# Altium schematic sheet power.SchDoc
size A4
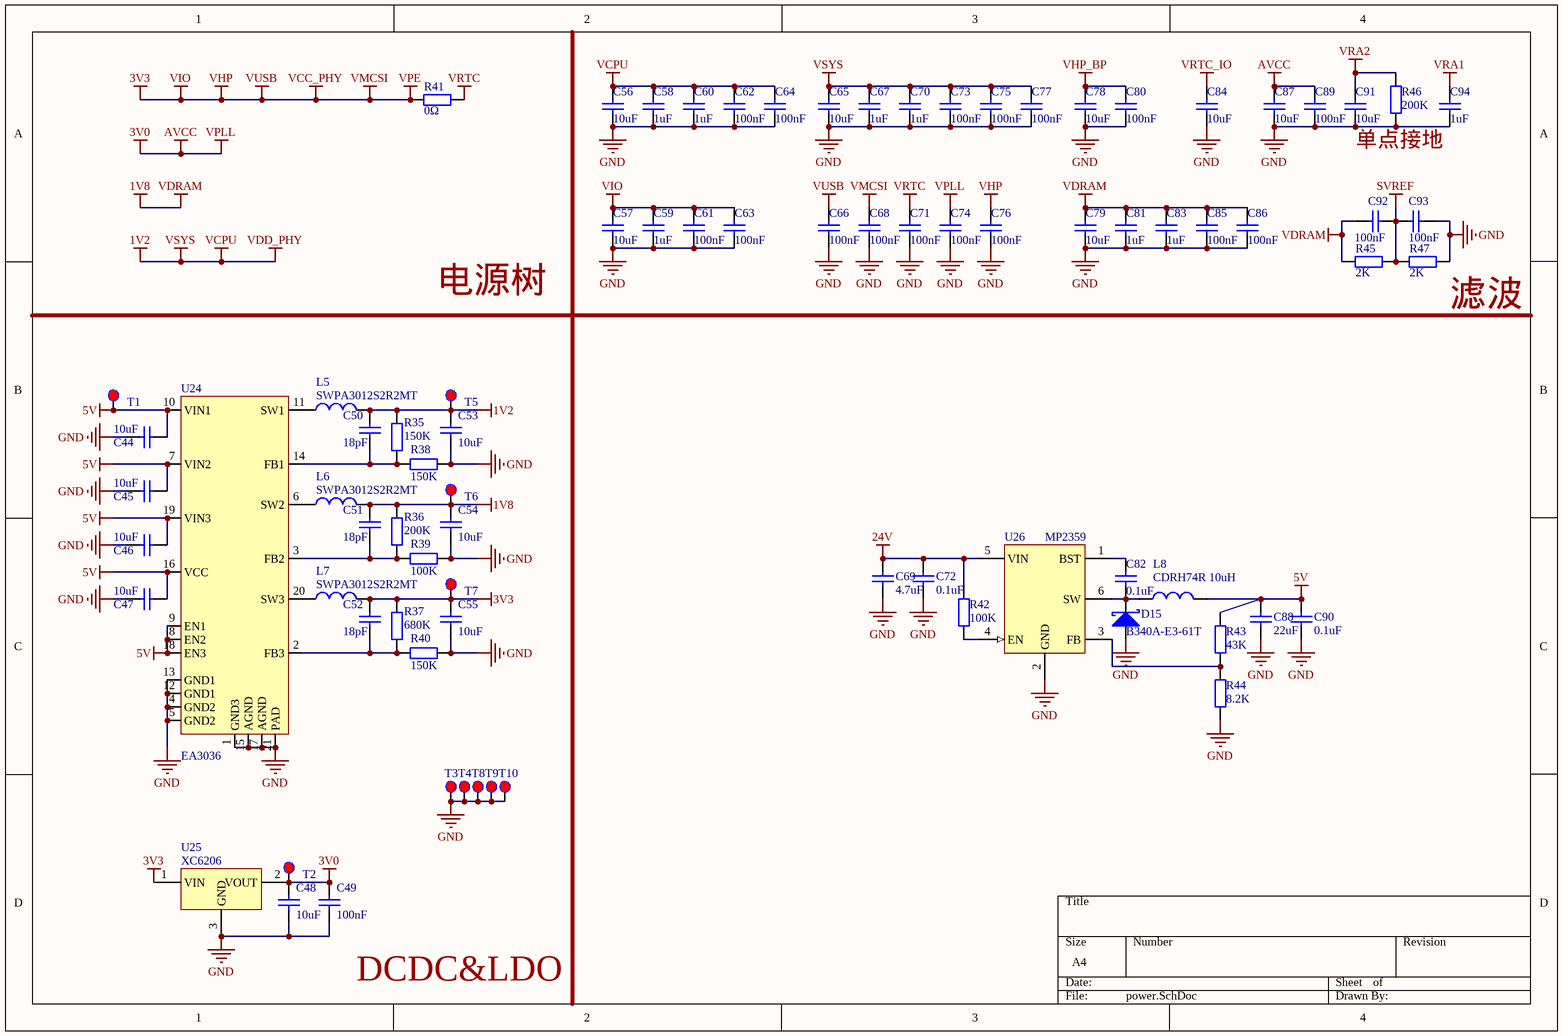
[diagram p0: power.SchDoc]

## Parts
C44  10uF  [CAPC1608L]
C45  10uF  [CAPC1608L]
C46  10uF  [CAPC1608L]
C47  10uF  [CAPC1608L]
C48  10uF  [CAPC1608L]
C49  100nF  [CAPC1608L]
C50  18pF  [CAPC1608L]
C51  18pF  [CAPC1608L]
C52  18pF  [CAPC1608L]
C53  10uF  [CAPC1608L]
C54  10uF  [CAPC1608L]
C55  10uF  [CAPC1608L]
C56  10uF  [CAPC1608L]
C57  10uF  [CAPC1608L]
C58  1uF  [CAPC1608L]
C59  1uF  [CAPC1608L]
C60  1uF  [CAPC1608L]
C61  100nF  [CAPC1608L]
C62  100nF  [CAPC1608L]
C63  100nF  [CAPC1608L]
C64  100nF  [CAPC1608L]
C65  10uF  [CAPC1608L]
C66  100nF  [CAPC1608L]
C67  1uF  [CAPC1608L]
C68  100nF  [CAPC1608L]
C69  4.7uF  [CAPC3216L]
C70  1uF  [CAPC1608L]
C71  100nF  [CAPC1608L]
C72  0.1uF  [CAPC2012L]
C73  100nF  [CAPC1608L]
C74  100nF  [CAPC1608L]
C75  100nF  [CAPC1608L]
C76  100nF  [CAPC1608L]
C77  100nF  [CAPC1608L]
C78  10uF  [CAPC1608L]
C79  10uF  [CAPC1608L]
C80  100nF  [CAPC1608L]
C81  1uF  [CAPC1608L]
C82  0.1uF  [CAPC1608L]
C83  1uF  [CAPC1608L]
C84  10uF  [CAPC1608L]
C85  100nF  [CAPC1608L]
C86  100nF  [CAPC1608L]
C87  10uF  [CAPC1608L]
C88  22uF  [CAPC3216L]
C89  100nF  [CAPC1608L]
C90  0.1uF  [CAPC2012L]
C91  10uF  [CAPC1608L]
C92  100nF  [CAPC1608L]
C93  100nF  [CAPC1608L]
C94  1uF  [CAPC1608L]
D15  B340A-E3-61T  [DO-214AC]
L5  SWPA3012S2R2MT  [IND3012_L]
L6  SWPA3012S2R2MT  [IND3012_L]
L7  SWPA3012S2R2MT  [IND3012_L]
L8  CDRH74R 10uH  [IND_7545]
R35  150K  [RESC1608L]
R36  200K  [RESC1608L]
R37  680K  [RESC1608L]
R38  150K  [RESC1608L]
R39  100K  [RESC1608L]
R40  150K  [RESC1608L]
R41  0Ω  [RESC1608L]
R42  100K  [RESC1608L]
R43  43K  [RESC1608L]
R44  8.2K  [RESC1608L]
R45  2K  [RESC1608L]
R46  200K  [RESC1608L]
R47  2K  [RESC1608L]
T1  TEST_POINT  [TEST_POINT_0.8]  (value not drawn)
T2  TEST_POINT  [TEST_POINT_0.8]  (value not drawn)
T3  TEST_POINT  [TEST_POINT_0.8]  (value not drawn)
T4  TEST_POINT  [TEST_POINT_0.8]  (value not drawn)
T5  TEST_POINT  [TEST_POINT_0.8]  (value not drawn)
T6  TEST_POINT  [TEST_POINT_0.8]  (value not drawn)
T7  TEST_POINT  [TEST_POINT_0.8]  (value not drawn)
T8  TEST_POINT  [TEST_POINT_0.8]  (value not drawn)
T9  TEST_POINT  [TEST_POINT_0.8]  (value not drawn)
T10  TEST_POINT  [TEST_POINT_0.8]  (value not drawn)
U24  EA3036  [QFN20_L]
U25  XC6206  [SOT23_L]
U26  MP2359  [SOT23-6_L]

## Nets
1V2: C50.2 C53.2 C56.2 C58.2 C60.2 C62.2 C64.2 C65.2 C67.2 C70.2 C73.2 C75.2 C77.2 L5.2 R35.2 T5.1  [also labelled VCPU, VDD_PHY, VSYS]
1V8: C51.2 C54.2 C79.2 C81.2 C83.2 C85.2 C86.2 C92.2 L6.2 R36.2 R45.1 T6.1  [also labelled VDRAM]
3V0: C48.2 C49.2 C74.2 C87.2 C89.2 T2.1 U25.2(VOUT)  [also labelled AVCC, VPLL]
3V3: C52.2 C55.2 C57.2 C59.2 C61.2 C63.2 C66.2 C68.2 C76.2 L7.2 R37.2 R41.1 T7.1 U25.1(VIN)  [also labelled VCC_PHY, VHP, VIO, VMCSI, VPE, VUSB]
5V: C44.1 C45.1 C46.1 C47.1 C88.2 C90.2 L8.2 R43.2 T1.1 U24.7(VIN2) U24.8(EN2) U24.9(EN1) U24.10(VIN1) U24.16(VCC) U24.18(EN3) U24.19(VIN3)
24V: C69.2 C72.2 R42.2 U26.5(VIN)
GND: C44.2 C45.2 C46.2 C47.2 C48.1 C49.1 C53.1 C54.1 C55.1 C56.1 C57.1 C58.1 C59.1 C60.1 C61.1 C62.1 C63.1 C64.1 C65.1 C66.1 C67.1 C68.1 C69.1 C70.1 C71.1 C72.1 C73.1 C74.1 C75.1 C76.1 C77.1 C78.1 C79.1 C80.1 C81.1 C83.1 C84.1 C85.1 C86.1 C87.1 C88.1 C89.1 C90.1 C91.1 C93.1 C94.1 D15.1(A) R38.1 R39.1 R40.1 R44.1 R46.1 R47.2 T3.1 T4.1 T8.1 T9.1 T10.1 U24.1(GND3) U24.4(GND2) U24.5(GND2) U24.12(GND1) U24.13(GND1) U24.15(AGND) U24.17(AGND) U24.21(PAD) U25.3(GND) U26.2(GND)
SVREF: C92.1 C93.2 R45.2 R47.1
VHP_BP: C78.2 C80.2
VRA1: C94.2
VRA2: C91.2 R46.2
VRTC: C71.2 R41.2
VRTC_IO: C84.2
NetC50_1: C50.1 R35.1 R38.2 U24.14(FB1)
NetC51_1: C51.1 R36.1 R39.2 U24.3(FB2)
NetC52_1: C52.1 R37.1 R40.2 U24.2(FB3)
NetC82_1: C82.1 D15.2(K) L8.1 U26.6(SW)
NetC82_2: C82.2 U26.1(BST)
NetL5_1: L5.1 U24.11(SW1)
NetL6_1: L6.1 U24.6(SW2)
NetL7_1: L7.1 U24.20(SW3)
NetR42_1: R42.1 U26.4(EN)
NetR43_1: R43.1 R44.2 U26.3(FB)

## Notes on the sheet
- 单点接地
- 电源树
- (near R47) 滤波
- (near C49) DCDC&LDO

## Library data of the parts
C44-C94 = Cap1: Capacitor; Published: 8-Jun-2000; LatestRevisionDate: 17-Jul-2002; LatestRevisionNote: Re-released for DXP Platform.; PackageReference: RAD-0.3; Publisher: Altium Limited
  C44-C48 C53-C57 C65 C78 C79 C84 C87 C91: Value: 10uF
  C49 C61-C64 C66 C68 C71 C73-C77 C80 C85 C86 C89 C92 C93: Value: 100nF
  C50-C52: Value: 18pF
  C58-C60 C67 C70 C81 C83 C94: Value: 1uF
  C69: Value: 4.7uF
  C72 C82 C90: Value: 0.1uF
  C88: Value: 22uF
D15 = D Schottky: Schottky Diode; Published: 8-Jun-2000; LatestRevisionDate: 17-Jul-2002; LatestRevisionNote: Re-released for DXP Platform.; PackageReference: SMB; Publisher: Altium Limited; Code_JEDEC: DO-214-AA
L5-L8 = Inductor: Code_IEC: 1005; Published: 8-Jun-2000; LatestRevisionDate: 29-May-2009; LatestRevisionNote: IPC-7351 Footprint Added.; PackageReference: 0402-A; Publisher: Altium Limited; PackageDescription: Chip Inductor; Code_JEITA: 0402
  L5-L7: Value: SWPA3012S2R2MT
  L8: Value: CDRH74R 10uH
R35-R47 = Res1: Resistor; Published: 8-Jun-2000; LatestRevisionDate: 17-Jul-2002; LatestRevisionNote: Re-released for DXP Platform.; PackageReference: AXIAL-0.4; Publisher: Altium Limited
  R35 R38 R40: Value: 150K
  R36 R46: Value: 200K
  R37: Value: 680K
  R39 R42: Value: 100K
  R41: Value: 0Ω
  R43: Value: 43K
  R44: Value: 8.2K
  R45 R47: Value: 2K
T1-T10 = TEST_POINT: 测试点
U25 = LDO-SOT23-3
U26 = MP2359: 1.2A, 24V, 1.4MHz异步降压转换器